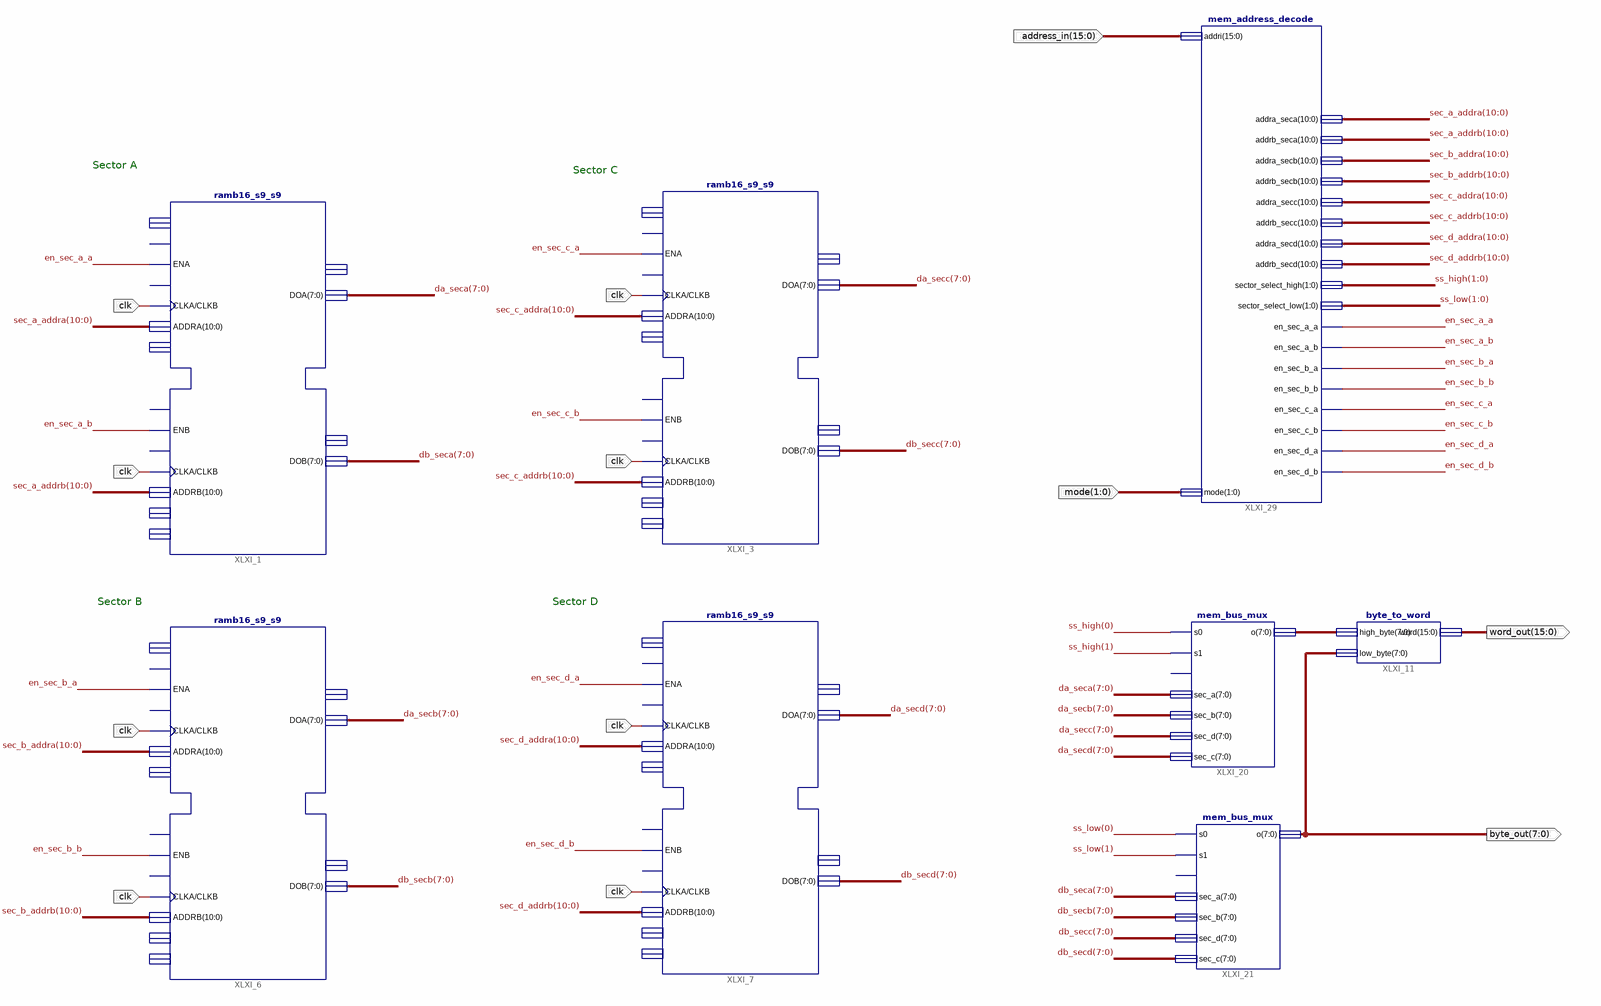
[diagram p0: schematic sheet 1]
// Xilinx ISE schematic memory.sch (spartan3e) as structural Verilog: 8 symbols, 5 ports
module memory (
  input  [15:0] address_in,
  input  clk,
  input  [1:0] mode,
  output [7:0] byte_out,
  output [15:0] word_out
);

  wire en_sec_a_a, en_sec_a_b, en_sec_b_a, en_sec_b_b, en_sec_c_a, en_sec_c_b, en_sec_d_a, en_sec_d_b;
  wire [1:0] ss_high, ss_low;
  wire [7:0] da_seca, da_secb, da_secc, da_secd, db_seca, db_secb, db_secc, db_secd, XLXN_129;
  wire [10:0] sec_a_addra, sec_a_addrb, sec_b_addra, sec_b_addrb, sec_c_addra, sec_c_addrb, sec_d_addra,
       sec_d_addrb;

  ramb16_s9_s9 XLXI_1 (
    .ADDRA(sec_a_addra), .ADDRB(sec_a_addrb), .CLKA(clk), .CLKB(clk), .ENA(en_sec_a_a), .ENB(en_sec_a_b),
    .DOA(da_seca), .DOB(db_seca));  // open: DIA, DIB, DIPA, DIPB, SSRA, SSRB, WEA, WEB, DOPA, DOPB
  ramb16_s9_s9 XLXI_6 (
    .ADDRA(sec_b_addra), .ADDRB(sec_b_addrb), .CLKA(clk), .CLKB(clk), .ENA(en_sec_b_a), .ENB(en_sec_b_b),
    .DOA(da_secb), .DOB(db_secb));  // open: DIA, DIB, DIPA, DIPB, SSRA, SSRB, WEA, WEB, DOPA, DOPB
  ramb16_s9_s9 XLXI_3 (
    .ADDRA(sec_c_addra), .ADDRB(sec_c_addrb), .CLKA(clk), .CLKB(clk), .ENA(en_sec_c_a), .ENB(en_sec_c_b),
    .DOA(da_secc), .DOB(db_secc));  // open: DIA, DIB, DIPA, DIPB, SSRA, SSRB, WEA, WEB, DOPA, DOPB
  ramb16_s9_s9 XLXI_7 (
    .ADDRA(sec_d_addra), .ADDRB(sec_d_addrb), .CLKA(clk), .CLKB(clk), .ENA(en_sec_d_a), .ENB(en_sec_d_b),
    .DOA(da_secd), .DOB(db_secd));  // open: DIA, DIB, DIPA, DIPB, SSRA, SSRB, WEA, WEB, DOPA, DOPB
  mem_address_decode XLXI_29 (
    .addri(address_in), .en_sec_a_a(en_sec_a_a), .en_sec_a_b(en_sec_a_b), .en_sec_b_a(en_sec_b_a),
    .en_sec_b_b(en_sec_b_b), .en_sec_c_a(en_sec_c_a), .en_sec_c_b(en_sec_c_b), .en_sec_d_a(en_sec_d_a),
    .en_sec_d_b(en_sec_d_b), .addra_seca(sec_a_addra), .addrb_seca(sec_a_addrb), .addra_secb(sec_b_addra),
    .addrb_secb(sec_b_addrb), .addra_secc(sec_c_addra), .addrb_secc(sec_c_addrb), .addra_secd(sec_d_addra),
    .addrb_secd(sec_d_addrb), .sector_select_high(ss_high), .sector_select_low(ss_low), .mode(mode));
  mem_bus_mux XLXI_21 (
    .s0(ss_low[0]), .s1(ss_low[1]), .sec_a(db_seca), .sec_b(db_secb), .sec_d(db_secc), .sec_c(db_secd),
    .o(byte_out));  // open: en
  mem_bus_mux XLXI_20 (
    .s0(ss_high[0]), .s1(ss_high[1]), .sec_a(da_seca), .sec_b(da_secb), .sec_d(da_secc), .sec_c(da_secd),
    .o(XLXN_129));  // open: en
  byte_to_word XLXI_11 (.high_byte(XLXN_129), .low_byte(byte_out), .word(word_out));

  // Notes on the sheet:
  //   Sector A
  //   Sector C
  //   Sector B
  //   Sector D
endmodule
